# Altium project LPHR_WeatherStationPCB.PrjPcb (part 3 of 3)
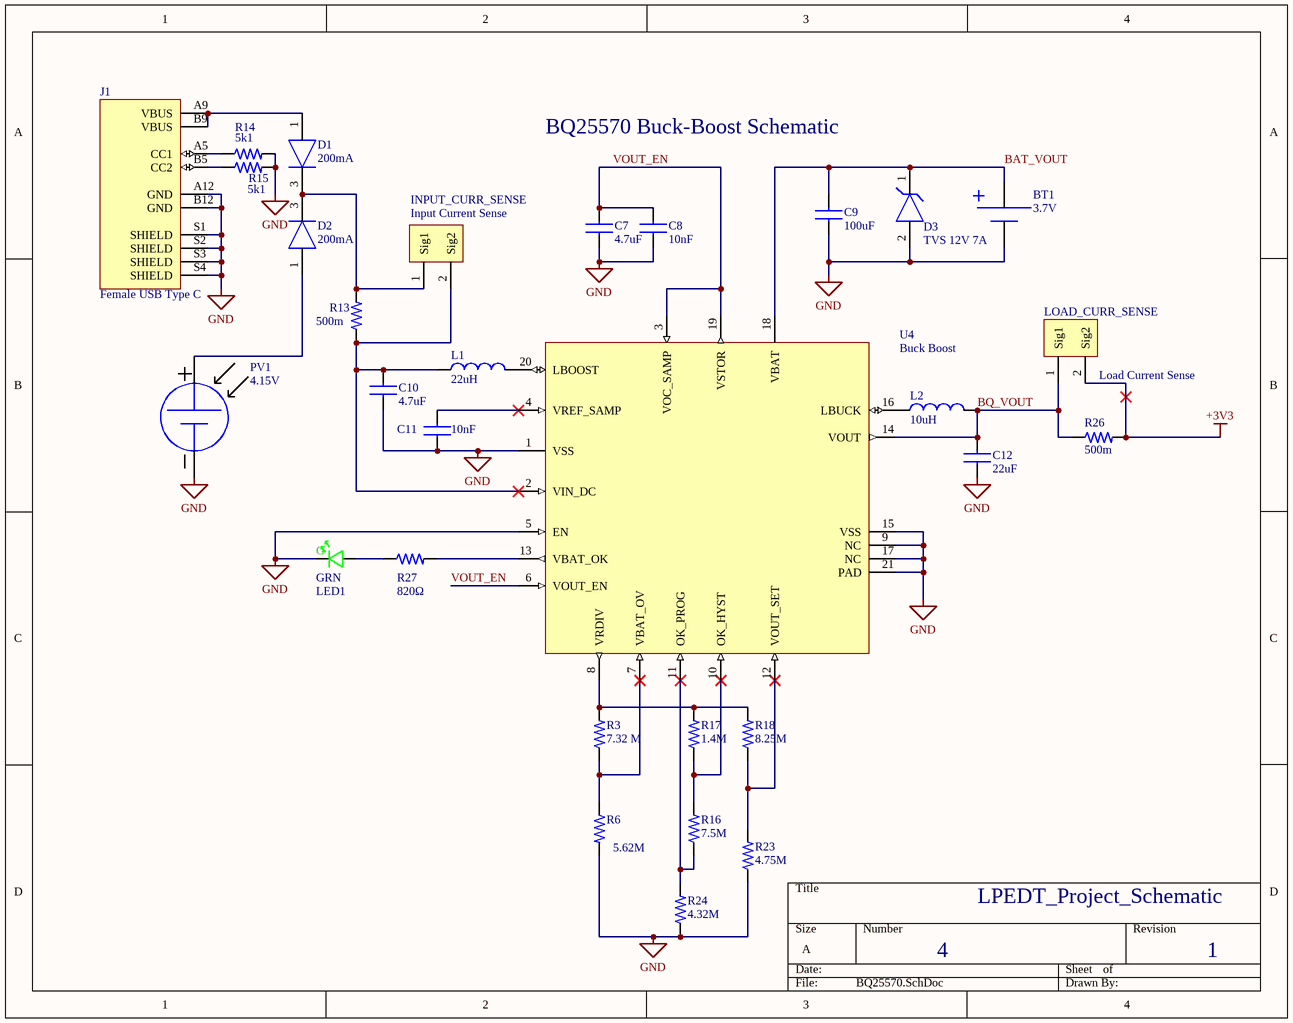
[diagram p8: BQ25570.SchDoc]

## Sheet BQ25570.SchDoc: LPEDT_Project_Schematic (continued)

### Library data of the parts (continued)
U4 = U_BQ25570RGRR: Power Supply Support Circuit, Adjustable, 1 Channel, PQCC20; Manufacturer: Texas Instruments; Package Body Material: Plastic; Channels: 1; Adjustable Threshold: Yes; Max Supply Voltage: 5.1V; Min Supply Voltage: 100mV; Supplier: Digikey; Supplier Part Number: 296-39934-1-ND; Manufacturer Part Number: BQ25570RGRR; RoHS: Yes; Category: Battery Management; Stock: 9240; Pricing: 1=7.11, 10=6.421, 25=6.1224, 100=5.3161, 250=5.07716, 500=4.62918, 1000=4.03187 (USD); Case/Package: HVQCCN; Pins: 20; Package Shape: Square; Terminal Finish: Nickel; Min Operating Temperature: -40°C; Max Operating Temperature: 85°C; Surface Mount: Yes; JESD-609 Code: e4; Throw Configuration: POWER SUPPLY SUPPORT CIRCUIT; Moisture Sensitivity Level: 2; Number of Channels: 1; Package Style: CHIP CARRIER, HEAT SINK/SLUG, VERY THIN PROFILEMeter; Peak Reflow Temperature (Cel): 260°C; Terminal Form: No Lead; Terminal Position: QUAD; Length: 3.5mm; Width: 3.5mm; Height - Seated (Max): 1mm; Terminal Pitch: 0.5mm; Reach SVHC Compliant: Yes; RoHS Compliant: Yes; Temperature Grade: INDUSTRIAL; ComponentLink1URL: https://www.ti.com:443/lit/ds/symlink/bq25570.pdf?src-supplier=IHS+Markit; ComponentLink1Description: https://www.ti.com:443/lit/ds/symlink/bq25570.pdf?src-supplier=IHS+Markit; ComponentLink2URL: https://datasheet.ciiva.com/29590/bq25570-29590060.pdf?src-supplier=Digikey; ComponentLink2Description: https://datasheet.ciiva.com/29590/bq25570-29590060.pdf?src-supplier=Digikey

## Sheet EFR32BG24_PartB.SchDoc: LPEDT_Project_Schematic
size A; Revision: 1; SheetNumber: 5; SheetTotal: 7
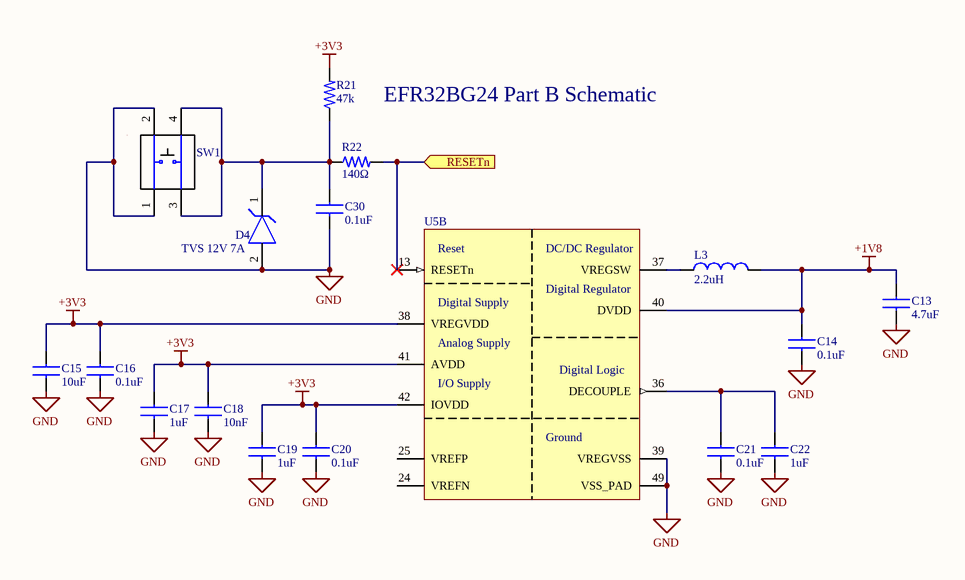
[diagram p4: EFR32BG24_PartB.SchDoc]

### Parts
C13  4.7uF  [C_0603]
C14  0.1uF  [C_0603]
C15  10uF  [C_0603]
C16  0.1uF  [C_0603]
C17  1uF  [C_0603]
C18  10nF  [C_0603]
C19  1uF  [C_0603]
C20  0.1uF  [C_0603]
C21  0.1uF  [C_0603]
C22  1uF  [C_0603]
C30  0.1uF  [C_0603]
D4  TVS 12V 7A  [D_TVS]
L3  2.2uH  [L_2828x30]
R21  47k  [R_0603]
R22  140Ω  [R_0603]
SW1  SW_TactilePushButton  [SW_Tactile]  (value not drawn)
U5  EFR32BG24B110F1536IM48-B  [U_48QFN_6x6_2]  (value not drawn)  (part B of 3)

### Ports
RESETn (in, see EFR32BG24_PartC[4A])

### Nets
+1V8: C13.1 C14.1 L3.2 U5.40(DVDD)
+3V3: C15.1 C16.2 C17.2 C18.1 C19.2 C20.2 R21.2 U5.38(VREGVDD) U5.41(AVDD) U5.42(IOVDD)
GND: C13.2 C14.2 C15.2 C16.1 C17.1 C18.2 C19.1 C20.1 C21.2 C22.2 C30.2 D4.2 SW1.1 SW1.2 U5.39(VREGVSS) U5.49(VSS_PAD)
NetC21_1: C21.1 C22.1 U5.36(DECOUPLE)
NetC30_1: C30.1 D4.1 R21.1 R22.1 SW1.3 SW1.4
NetH1_3: R22.2 U5.13(RESETn) ; port RESETn
NetL3_1: L3.1 U5.37(VREGSW)

Not connected (* = marked no-connect by the designer): U5 24(VREFN) 25(VREFP)

### Notes on the sheet
- EFR32BG24 Part B Schematic
- (in symbol EFR32BG24B110F1536IM48-B, part B) Reset; DC/DC Regulator; Digital Regulator; Digital Supply; Analog Supply; Digital Logic; I/O Supply; Ground

### Library data of the parts
C13 = C_4.7U_0603: CAP CER 4.7UF 10V X5R 0603; Manufacturer: Murata; Manufacturer Part Number: GRM188R61A475KAAJD; Dielectric Material: Ceramic; Multilayer: Yes; Tolerance  (fill in as +-): 10%; Supplier: Digikey; Supplier Part Number: 490-14373-1-ND; RoHS: Yes; Category: Ceramic Capacitors; Stock: 53982; Pricing: 1=0.38, 10=0.251, 50=0.185, 100=0.1506, 500=0.11888, 1000=0.10039 (USD); Mounting Technology: Surface Mount; Pins: 2; Package Shape: Rectangular; Case/Package: 0603; Terminal Finish: Nickel; Min Operating Temperature: -55°C; Max Operating Temperature: 85°C; JESD-609 Code: e3; Value: 4.7uF; Capacitor Type: Ceramic; Packaging: Tape and Reel; Tolerance (fill in as +-): 10%; Rated DC Voltage (URdc): 10V; Temperature Characteristics Code: X5R; Termination: Wraparound; Reach SVHC Compliant: Yes; RoHS Compliant: Yes; ComponentLink1URL: https://datasheet.ciiva.com:443/pdfs/VipMasterIC/IC/MURE/MURE-S-A0004349797/MURE-S-A0004352595-1.pdf?src-supplier=IHS+Markit; ComponentLink1Description: https://datasheet.ciiva.com:443/pdfs/VipMasterIC/IC/MURE/MURE-S-A0004349797/MURE-S-A0004352595-1.pdf?src-supplier=IHS+Markit; ComponentLink2URL: http://search.murata.co.jp/Ceramy/image/img/A01X/G101/ENG/GRM188R61A475KAAJ-01.pdf?src-supplier=Digikey; ComponentLink2Description: http://search.murata.co.jp/Ceramy/image/img/A01X/G101/ENG/GRM188R61A475KAAJ-01.pdf?src-supplier=Digikey
C14 C16 C20 C21 C30 = C_0.1U_0603: CAP CER 0.1UF 10V X5R 0603; Manufacturer: KEMET; Manufacturer Part Number: C0603C104K8PAC7867; Dielectric Material: Ceramic; Supplier: Digikey; Supplier Part Number: 399-17573-1-ND; RoHS: Yes; Category: Ceramic Capacitors; Stock: 13122; Pricing: 1=0.18, 10=0.119, 50=0.075, 100=0.06, 500=0.04332, 1000=0.03833 (USD); Pins: 2; Capacitor Type: Ceramic; Reach SVHC Compliant: Yes; RoHS Compliant: Yes; ComponentLink1URL: https://datasheet.ciiva.com:443/pdfs/VipMasterIC/IC/KEME/KEME-S-A0007617622/KEME-S-A0007611556-1.pdf?src-supplier=IHS+Markit; ComponentLink1Description: https://datasheet.ciiva.com:443/pdfs/VipMasterIC/IC/KEME/KEME-S-A0007617622/KEME-S-A0007611556-1.pdf?src-supplier=IHS+Markit; ComponentLink2URL: https://api.kemet.com/component-edge/download/datasheet/C0603C104K8PAC7867.pdf?src-supplier=Digikey; ComponentLink2Description: https://api.kemet.com/component-edge/download/datasheet/C0603C104K8PAC7867.pdf?src-supplier=Digikey
C15 = C_10U_0603: CAP CER 10UF 10V X5R 0603; Manufacturer: Murata; Manufacturer Part Number: GRM188R61A106ME69D; Dielectric Material: Ceramic; Multilayer: Yes; Tolerance  (fill in as +-): 20%; Supplier: Digikey; Supplier Part Number: 490-10475-1-ND; RoHS: Yes; Category: Ceramic Capacitors; Stock: 841748; Pricing: 1=0.14, 10=0.098, 50=0.0584, 100=0.0459, 500=0.03392, 1000=0.02809 (USD); Mounting Technology: Surface Mount; Pins: 2; Package Shape: Rectangular; Case/Package: 0603; Terminal Finish: Nickel; Min Operating Temperature: -55°C; Max Operating Temperature: 85°C; JESD-609 Code: e3; Value: 10uF; Capacitor Type: Ceramic; Packaging: Tape and Reel; Tolerance (fill in as +-): 20%; Rated DC Voltage (URdc): 10V; Temperature Characteristics Code: X5R; Termination: Wraparound; Reach SVHC Compliant: Yes; RoHS Compliant: Yes; ComponentLink1URL: https://datasheet.ciiva.com:443/pdfs/VipMasterIC/IC/MURE/MURE-S-A0004349797/MURE-S-A0004352786-1.pdf?src-supplier=IHS+Markit; ComponentLink1Description: https://datasheet.ciiva.com:443/pdfs/VipMasterIC/IC/MURE/MURE-S-A0004349797/MURE-S-A0004352786-1.pdf?src-supplier=IHS+Markit; ComponentLink2URL: http://www.farnell.com/datasheets/1872210.pdf?src-supplier=Farnell; ComponentLink2Description: http://www.farnell.com/datasheets/1872210.pdf?src-supplier=Farnell; ComponentLink3URL: http://www.mouser.com/ds/2/281/c02e-2905.pdf?src-supplier=Mouser; ComponentLink3Description: http://www.mouser.com/ds/2/281/c02e-2905.pdf?src-supplier=Mouser; ComponentLink4URL: https://datasheet.octopart.com/GRM188R61A106ME69D-Murata-datasheet-22122223.pdf?src-supplier=Future+Electronics; ComponentLink4Description: https://datasheet.octopart.com/GRM188R61A106ME69D-Murata-datasheet-22122223.pdf?src-supplier=Future+Electronics; ComponentLink5URL: https://datasheet.octopart.com/GRM188R61A106ME69D-Murata-datasheet-62317187.pdf?src-supplier=Element14; ComponentLink5Description: https://datasheet.octopart.com/GRM188R61A106ME69D-Murata-datasheet-62317187.pdf?src-supplier=Element14; ComponentLink6URL: http://www.farnell.com/datasheets/1872210.pdf?src-supplier=Newark; ComponentLink6Description: http://www.farnell.com/datasheets/1872210.pdf?src-supplier=Newark; ComponentLink7URL: http://www.farnell.com/datasheets/2048014.pdf?src-supplier=Element14; ComponentLink7Description: http://www.farnell.com/datasheets/2048014.pdf?src-supplier=Element14; ComponentLink8URL: https://datasheet.octopart.com/GRM188R61A106ME69D-Murata-datasheet-165579666.pdf?src-supplier=TME; ComponentLink8Description: https://datasheet.octopart.com/GRM188R61A106ME69D-Murata-datasheet-165579666.pdf?src-supplier=TME
C17 C19 C22 = C_1U_0603: CAP CER 1UF 10V X5R 0603; Manufacturer: Murata; Manufacturer Part Number: GRM188R61A105KA61D; Dielectric Material: Ceramic; Multilayer: Yes; Tolerance  (fill in as +-): 10%; Supplier: Digikey; Supplier Part Number: 490-1543-1-ND; RoHS: Yes; Category: Ceramic Capacitors; Stock: 1314759; Pricing: 1=0.12, 10=0.08, 50=0.048, 100=0.0378, 500=0.02794, 1000=0.02313 (USD); Mounting Technology: Surface Mount; Pins: 2; Package Shape: Rectangular; Case/Package: 0603; Terminal Finish: Nickel; Min Operating Temperature: -55°C; Max Operating Temperature: 85°C; JESD-609 Code: e3; Value: 1uF; Capacitor Type: Ceramic; Package Style: SMTMeter; Packaging: Tape and Reel; Tolerance (fill in as +-): 10%; Rated DC Voltage (URdc): 10V; Temperature Characteristics Code: X5R; Termination: Wraparound; Length: 1.6mm; Width: 0.8mm; Height: 0.8mm; Reach SVHC Compliant: Yes; RoHS Compliant: Yes; ComponentLink1URL: https://psearch.en.murata.com:443/capacitor/product/GRM188R61A105KA61%23.pdf?src-supplier=IHS+Markit; ComponentLink1Description: https://psearch.en.murata.com:443/capacitor/product/GRM188R61A105KA61%23.pdf?src-supplier=IHS+Markit; ComponentLink2URL: https://datasheet.ciiva.com/19476/1857381-19476568.pdf?src-supplier=Jameco; ComponentLink2Description: https://datasheet.ciiva.com/19476/1857381-19476568.pdf?src-supplier=Jameco; ComponentLink3URL: https://datasheet.ciiva.com/18102/getdatasheetpartid-85467-18102910.pdf?src-supplier=Verical; ComponentLink3Description: https://datasheet.ciiva.com/18102/getdatasheetpartid-85467-18102910.pdf?src-supplier=Verical; ComponentLink4URL: https://datasheet.ciiva.com/7719/608985-7719036.pdf?src-supplier=Element14; ComponentLink4Description: https://datasheet.ciiva.com/7719/608985-7719036.pdf?src-supplier=Element14; ComponentLink5URL: https://datasheet.ciiva.com/22706/608985-22706782.pdf?src-supplier=Element14; ComponentLink5Description: https://datasheet.ciiva.com/22706/608985-22706782.pdf?src-supplier=Element14; ComponentLink6URL: https://datasheet.ciiva.com/131/partnumbering-e-01-131742.pdf?src-supplier=Digikey; ComponentLink6Description: https://datasheet.ciiva.com/131/partnumbering-e-01-131742.pdf?src-supplier=Digikey; ComponentLink7URL: https://datasheet.ciiva.com/131/partnumbering-e-01-131741.pdf?src-supplier=Digikey; ComponentLink7Description: https://datasheet.ciiva.com/131/partnumbering-e-01-131741.pdf?src-supplier=Digikey; ComponentLink8URL: https://datasheet.ciiva.com/131/partnumbering-e-01-131743.pdf?src-supplier=Digikey; ComponentLink8Description: https://datasheet.ciiva.com/131/partnumbering-e-01-131743.pdf?src-supplier=Digikey; ComponentLink9URL: https://datasheet.ciiva.com/16199/product-16199724.pdf?src-supplier=Future+Electronics; ComponentLink9Description: https://datasheet.ciiva.com/16199/product-16199724.pdf?src-supplier=Future+Electronics
C18 = C_10N_0603: Ceramic Capacitor, Multilayer, Ceramic, 100V, 10% +Tol, 10% -Tol, X7R, 15% TC, 0.01uF, Surface Mount, 0603; Manufacturer: Murata; Manufacturer Part Number: GCM188R72A103KA37D; Multilayer: Yes; Reference Standard: AEC-Q200; Supplier: Digikey; Supplier Part Number: 490-4781-6-ND; RoHS: Yes; Category: Ceramic Capacitors; Stock: 7901608; Pricing: 1=0.1, 10=0.038, 50=0.0218, 100=0.0168, 500=0.01268, 1000=0.00996 (USD); Mounting Technology: Surface Mount; Pins: 2; Dielectric Material: Ceramic; Package Shape: Rectangular; Case/Package: 0603; Terminal Finish: Nickel; Min Operating Temperature: -55°C; Max Operating Temperature: 125°C; JESD-609 Code: e3; Value: 10nF; Capacitor Type: Ceramic; Tolerance  (fill in as +-): 10%; Package Style: SMTMeter; Packaging: Tape and Reel; Tolerance (fill in as +-): 10%; Rated DC Voltage (URdc): 100V; Temperature Characteristics Code: X7R; Termination: Wraparound; Length: 1.6mm; Width: 0.8mm; Height: 0.9mm; Reach SVHC Compliant: Yes; RoHS Compliant: Yes; ComponentLink1URL: https://psearch.en.murata.com:443/capacitor/product/GCM188R72A103KA37%23.pdf?src-supplier=IHS+Markit; ComponentLink1Description: https://psearch.en.murata.com:443/capacitor/product/GCM188R72A103KA37%23.pdf?src-supplier=IHS+Markit; ComponentLink2URL: https://datasheet.ciiva.com/132/product-132908.pdf?src-supplier=Digikey; ComponentLink2Description: https://datasheet.ciiva.com/132/product-132908.pdf?src-supplier=Digikey; ComponentLink3URL: https://datasheet.ciiva.com/132/product-132907.pdf?src-supplier=Digikey; ComponentLink3Description: https://datasheet.ciiva.com/132/product-132907.pdf?src-supplier=Digikey; ComponentLink4URL: https://datasheet.ciiva.com/132/product-132909.pdf?src-supplier=Digikey; ComponentLink4Description: https://datasheet.ciiva.com/132/product-132909.pdf?src-supplier=Digikey; ComponentLink5URL: https://datasheet.ciiva.com/11786/0900766b80ef92d0-11786108.pdf?src-supplier=Rs; ComponentLink5Description: https://datasheet.ciiva.com/11786/0900766b80ef92d0-11786108.pdf?src-supplier=Rs; ComponentLink6URL: https://datasheet.ciiva.com/16497/product-16497251.pdf?src-supplier=Future+Electronics; ComponentLink6Description: https://datasheet.ciiva.com/16497/product-16497251.pdf?src-supplier=Future+Electronics; ComponentLink7URL: https://datasheet.ciiva.com/18183/getdatasheetpartid-178890-18183651.pdf?src-supplier=Verical; ComponentLink7Description: https://datasheet.ciiva.com/18183/getdatasheetpartid-178890-18183651.pdf?src-supplier=Verical; ComponentLink8URL: https://datasheet.ciiva.com/11619/product-11619719.pdf?src-supplier=Avnet; ComponentLink8Description: https://datasheet.ciiva.com/11619/product-11619719.pdf?src-supplier=Avnet
D4 = D_TVS_7A: TVS DIODE 5VWM 12VC SOD723; Manufacturer: Littelfuse; Manufacturer Part Number: SP1003-01DTG; Direction: Unidirectional; Reverse Breakdown Voltage: 6V; Operating Supply Voltage: 5V; Value: 30pF; Number of Channels: 1; Power Line Protection: No; Polarity: Bidirectional,Unidirectional; Test Current: 1mA; Leakage Current: 100nA; Diode Type: ZENER; Clamping Voltage-Max: 12.5V; Supplier: Digikey; Supplier Part Number: F3377CT-ND; RoHS: Yes; Category: TVS Diodes; Stock: 109631; Pricing: 1=0.53, 10=0.41, 100=0.2459, 500=0.22772, 1000=0.15485, 2000=0.14255 (USD); Mounting Technology: Surface Mount; Pins: 2; Min Operating Temperature: -40°C; Max Operating Temperature: 85°C; Packaging: Tape and Reel; Package Quantity: 8000; Max Surge Current: 7A; Number of Unidirectional Channels: 1; Reverse Standoff Voltage: 5V; Min Breakdown Voltage: 6V; Clamping Voltage: 12V; Breakdown Voltage: 5V; Termination: SMD/SMT; Number of Elements: 1; Peak Pulse Current: 7A; Series: SP1003, SPA®; Reach SVHC Compliant: No; Lead Free: Lead Free; RoHS Compliant: Yes; ComponentLink1URL: https://datasheet.ciiva.com/8062/littelfuse-spa-sp1003-series-8062432.pdf?src-supplier=Element14; ComponentLink1Description: https://datasheet.ciiva.com/8062/littelfuse-spa-sp1003-series-8062432.pdf?src-supplier=Element14; ComponentLink2URL: https://datasheet.ciiva.com/5771/littelfuse-spa-sp1003-series-5771141.pdf?src-supplier=Farnell; ComponentLink2Description: https://datasheet.ciiva.com/5771/littelfuse-spa-sp1003-series-5771141.pdf?src-supplier=Farnell; ComponentLink3URL: https://datasheet.ciiva.com/330/littelfuse-tvs-diode-array-sp1003-datasheet-pdf-330691.pdf?src-supplier=Digikey; ComponentLink3Description: https://datasheet.ciiva.com/330/littelfuse-tvs-diode-array-sp1003-datasheet-pdf-330691.pdf?src-supplier=Digikey; ComponentLink4URL: https://datasheet.ciiva.com/330/littelfuse-tvs-diode-array-sp1003-datasheet-pdf-330692.pdf?src-supplier=Digikey; ComponentLink4Description: https://datasheet.ciiva.com/330/littelfuse-tvs-diode-array-sp1003-datasheet-pdf-330692.pdf?src-supplier=Digikey; ComponentLink5URL: https://datasheet.ciiva.com/330/littelfuse-tvs-diode-array-sp1003-datasheet-pdf-330693.pdf?src-supplier=Digikey; ComponentLink5Description: https://datasheet.ciiva.com/330/littelfuse-tvs-diode-array-sp1003-datasheet-pdf-330693.pdf?src-supplier=Digikey
L3 = L_2U2_2828: General Purpose Inductor, 2.2uH, 20%, 1 Element, Ferrite-Core, SMD, 1111; Manufacturer: Wurth Electronics; Manufacturer Part Number: 744025002; Channels: 1; Case/Size Code: 1111; DC Resistance (DCR): 101mR; Inductor Application: RF INDUCTOR; Max Current Rating: 1.5A; Self Resonant Frequency: 100MHz; Shape/Size Description: RECTANGULAR PACKAGE; Shielding: Unshielded; Test Frequency: 100kHz; Package Height: 2.8mm; Supplier: Digikey; Supplier Part Number: 732-2613-1-ND; RoHS: Yes; Category: Fixed Inductors; Stock: 733; Pricing: 1=1.64, 10=1.578, 50=1.45, 100=1.205, 250=1.088 (USD); Pins: 2; Terminal Finish: Copper; Core Material: Ferrite; Min Operating Temperature: -40°C; Max Operating Temperature: 125°C; Tolerance: 20%; JESD-609 Code: e2; Package Style: SMTMeter; Surface Mount: Yes; Construction: Chip; Inductance-Nom (L): 2.2uH; Inductor Type: GENERAL PURPOSE INDUCTOR; Packaging: Tape and Reel; Terminal Placement: Dual Ended; Termination: Wraparound; Package Length: 2.8mm; Package Width: 2.8mm; Reach SVHC Compliant: Yes; RoHS Compliant: Yes; ComponentLink1URL: https://datasheet.ciiva.com:443/pdfs/VipMasterIC/IC/MIDC/MIDC-S-A0002801410/MIDC-S-A0002801309-1.pdf?src-supplier=IHS+Markit; ComponentLink1Description: https://datasheet.ciiva.com:443/pdfs/VipMasterIC/IC/MIDC/MIDC-S-A0002801410/MIDC-S-A0002801309-1.pdf?src-supplier=IHS+Markit; ComponentLink2URL: https://datasheet.ciiva.com/4954/744025002-18097-4954597.pdf?src-supplier=Mouser; ComponentLink2Description: https://datasheet.ciiva.com/4954/744025002-18097-4954597.pdf?src-supplier=Mouser; ComponentLink3URL: https://datasheet.ciiva.com/6690/744025002-6690395.pdf?src-supplier=Digikey; ComponentLink3Description: https://datasheet.ciiva.com/6690/744025002-6690395.pdf?src-supplier=Digikey; ComponentLink4URL: https://datasheet.ciiva.com/11803/0900766b80f886b4-11803596.pdf?src-supplier=Rs; ComponentLink4Description: https://datasheet.ciiva.com/11803/0900766b80f886b4-11803596.pdf?src-supplier=Rs; ComponentLink5URL: https://datasheet.ciiva.com/6690/744025002-6690396.pdf?src-supplier=Digikey; ComponentLink5Description: https://datasheet.ciiva.com/6690/744025002-6690396.pdf?src-supplier=Digikey; ComponentLink6URL: https://datasheet.ciiva.com/6690/744025002-6690397.pdf?src-supplier=Digikey; ComponentLink6Description: https://datasheet.ciiva.com/6690/744025002-6690397.pdf?src-supplier=Digikey; ComponentLink7URL: https://datasheet.ciiva.com/48690/001087101-da-01-ml-we-tpc-smd-speicherdrossel-7440250-de-en-48690919.pdf?src-supplier=Conrad; ComponentLink7Description: https://datasheet.ciiva.com/48690/001087101-da-01-ml-we-tpc-smd-speicherdrossel-7440250-de-en-48690919.pdf?src-supplier=Conrad
R21 = R_47K_0603: Fixed Resistor, Metal Glaze/thick Film, 0.1W, 47000ohm, 75V, 1% +/-Tol, 100ppm/Cel, Surface Mount, 0603; Manufacturer: Yageo; Manufacturer Part Number: RC0603FR-0747KL; Additional Feature: LASER TRIMMABLE; Power: 100mW; Rated Temperature: 70°C; Value: 47kR; Temperature Coefficient: 100ppm/°C; Package Height: 0.45mm; Package Length: 1.6mm; Package Width: 0.8mm; Supplier: Digikey; Supplier Part Number: 311-47.0KHRCT-ND; RoHS: Yes; Category: Chip SMD Resistors; Stock: 9516223; Pricing: 1=0.1, 10=0.019, 50=0.0112, 100=0.0093, 500=0.00622, 1000=0.00532 (USD); Mounting Technology: Surface Mount; Pins: 2; Package Shape: Rectangular; Case/Package: 0603; Terminal Finish: Nickel; Min Operating Temperature: -55°C; Max Operating Temperature: 155°C; Tolerance: 1%; JESD-609 Code: e3; Resistor Type: FIXED RESISTOR; Construction: Chip; Package Style: SMTMeter; Packaging: Tape and Reel; Technology: METAL GLAZE/THICK FILM; Termination: Wraparound; Working Voltage: 75V; Reach SVHC Compliant: Yes; RoHS Compliant: Yes; ComponentLink1URL: https://datasheet.ciiva.com:443/pdfs/VipMasterIC/IC/YAGO/YAGO-S-A0008145938/YAGO-S-A0008145938-1.pdf?src-supplier=IHS+Markit; ComponentLink1Description: https://datasheet.ciiva.com:443/pdfs/VipMasterIC/IC/YAGO/YAGO-S-A0008145938/YAGO-S-A0008145938-1.pdf?src-supplier=IHS+Markit; ComponentLink2URL: https://datasheet.ciiva.com/11808/0900766b80f96399-11808118.pdf?src-supplier=Rs; ComponentLink2Description: https://datasheet.ciiva.com/11808/0900766b80f96399-11808118.pdf?src-supplier=Rs; ComponentLink3URL: https://datasheet.ciiva.com/2453/pyu-r-int-thick-7-2453932.pdf?src-supplier=Digikey; ComponentLink3Description: https://datasheet.ciiva.com/2453/pyu-r-int-thick-7-2453932.pdf?src-supplier=Digikey; ComponentLink4URL: https://datasheet.ciiva.com/2453/pyu-r-int-thick-7-2453933.pdf?src-supplier=Digikey; ComponentLink4Description: https://datasheet.ciiva.com/2453/pyu-r-int-thick-7-2453933.pdf?src-supplier=Digikey; ComponentLink5URL: https://datasheet.ciiva.com/2453/pyu-r-int-thick-7-2453931.pdf?src-supplier=Digikey; ComponentLink5Description: https://datasheet.ciiva.com/2453/pyu-r-int-thick-7-2453931.pdf?src-supplier=Digikey; ComponentLink6URL: https://datasheet.ciiva.com/7746/443971-7746362.pdf?src-supplier=Element14; ComponentLink6Description: https://datasheet.ciiva.com/7746/443971-7746362.pdf?src-supplier=Element14; ComponentLink7URL: https://datasheet.ciiva.com/7746/443971-7746361.pdf?src-supplier=Element14; ComponentLink7Description: https://datasheet.ciiva.com/7746/443971-7746361.pdf?src-supplier=Element14
R22 = R_140_0603: RES 140OHM 0.1w 0603; Manufacturer: Yageo; Manufacturer Part Number: RC0603FR-07140RL; Tolerance: 1%; Additional Feature: LASER TRIMMABLE; Power: 100mW; Rated Temperature: 70°C; Value: 140R; Temperature Coefficient: 100ppm/°C; Working Voltage: 75V; Package Height: 0.45mm; Package Length: 1.6mm; Package Width: 0.8mm; Supplier: Digikey; Supplier Part Number: 311-140HRCT-ND; RoHS: Yes; Category: Chip SMD Resistors; Stock: 298380; Pricing: 1=0.1, 10=0.019, 50=0.0112, 100=0.0093, 500=0.00622, 1000=0.00532 (USD); Mounting Technology: Surface Mount; Pins: 2; Package Shape: Rectangular; Case/Package: 0603; Terminal Finish: Nickel; Min Operating Temperature: -55°C; Max Operating Temperature: 155°C; JESD-609 Code: e3; Resistor Type: FIXED RESISTOR; Construction: Chip; Package Style: SMTMeter; Packaging: Tape and Reel; Technology: METAL GLAZE/THICK FILM; Termination: Wraparound; Reach SVHC Compliant: Yes; RoHS Compliant: Yes; ComponentLink1URL: https://datasheet.ciiva.com:443/pdfs/VipMasterIC/IC/YAGO/YAGO-S-A0008145938/YAGO-S-A0008145938-1.pdf?src-supplier=IHS+Markit; ComponentLink1Description: https://datasheet.ciiva.com:443/pdfs/VipMasterIC/IC/YAGO/YAGO-S-A0008145938/YAGO-S-A0008145938-1.pdf?src-supplier=IHS+Markit; ComponentLink2URL: https://datasheet.ciiva.com/11808/0900766b80c66297-11808828.pdf?src-supplier=Rs; ComponentLink2Description: https://datasheet.ciiva.com/11808/0900766b80c66297-11808828.pdf?src-supplier=Rs; ComponentLink3URL: https://datasheet.ciiva.com/15189/getdatasheetpartid-329205-15189606.pdf?src-supplier=Verical; ComponentLink3Description: https://datasheet.ciiva.com/15189/getdatasheetpartid-329205-15189606.pdf?src-supplier=Verical
SW1 = SW_TactilePushButton: 6 x 6 mm, 4.3 ~ 17 mm Actuator Height, 100 ~ 260 gf, Through Hole, SPST, Tactile Switch; Manufacturer: CUI Devices; Manufacturer Part Number: TS02-66-60-BK-100-LCR-D; Supplier: Digikey; Supplier Part Number: 2223-TS02-66-60-BK-100-LCR-D-ND; RoHS: No; Category: Tactile Switches; Stock: 3824; Pricing: 1=0.1, 10=0.097, 25=0.0916, 100=0.0833, 250=0.07832, 500=0.07166, 1000=0.05999, 2500=0.05833, 5000=0.05499 (USD)
U5 = EFR32BG24B110F1536IM48-B: BG24, 2.4 GHz, 1536kB Flash, 256kB RAM, +10 dBm, Secure Vault High, 20-bit ADC +125C, QFN48; Manufacturer: Silicon Labs; Supplier: Digikey; Supplier Part Number: 336-EFR32BG24B110F1536IM48-B-ND; Manufacturer Part Number: EFR32BG24B110F1536IM48-B; RoHS: No; Category: RF Receivers, Transceivers; Stock: 2713; Pricing: 1=7.9, 10=7.244, 25=6.5852, 80=5.92663, 230=5.43278, 490=4.9389, 980=4.44501 (USD)

## Sheet EFR32BG24_PartC.SchDoc: LPEDT_Project_Schematic
size A; Revision: 1; SheetNumber: 6; SheetTotal: 7
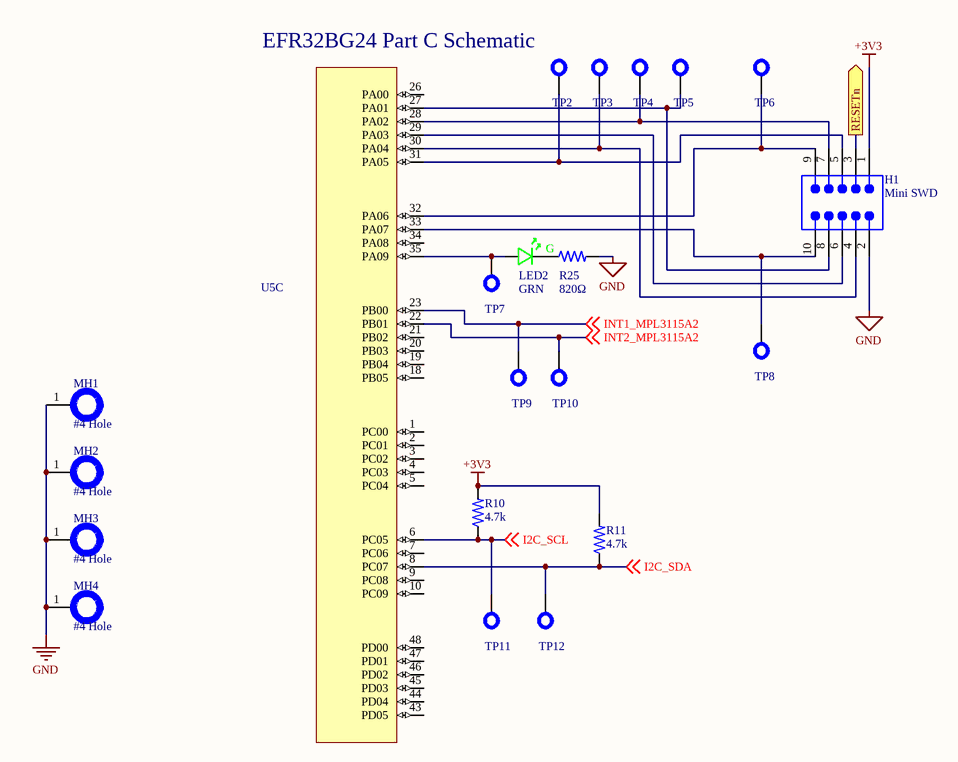
[diagram p5: EFR32BG24_PartC.SchDoc]

### Parts
H1  Mini SWD  [FTSH-105-01-XXX-DV-K]
LED2  GRN  [LED_0603]
MH1  #4 Hole  [HOLE_#4]  (no BOM)
MH2  #4 Hole  [HOLE_#4]  (no BOM)
MH3  #4 Hole  [HOLE_#4]  (no BOM)
MH4  #4 Hole  [HOLE_#4]  (no BOM)
R10  4.7k  [R_0603]
R11  4.7k  [R_0603]
R25  820Ω  [R_0603]
TP2  TP_1PIN_Hole  [Test Point]  (value not drawn)
TP3  TP_1PIN_Hole  [Test Point]  (value not drawn)
TP4  TP_1PIN_Hole  [Test Point]  (value not drawn)
TP5  TP_1PIN_Hole  [Test Point]  (value not drawn)
TP6  TP_1PIN_Hole  [Test Point]  (value not drawn)
TP7  TP_1PIN_Hole  [Test Point]  (value not drawn)
TP8  TP_1PIN_Hole  [Test Point]  (value not drawn)
TP9  TP_1PIN_Hole  [Test Point]  (value not drawn)
TP10  TP_1PIN_Hole  [Test Point]  (value not drawn)
TP11  TP_1PIN_Hole  [Test Point]  (value not drawn)
TP12  TP_1PIN_Hole  [Test Point]  (value not drawn)
U5  EFR32BG24B110F1536IM48-B  [U_48QFN_6x6_2]  (value not drawn)  (part C of 3)

### Ports
RESETn (out, see EFR32BG24_PartB[2A])

### Nets
+3V3: H1.1 R10.2 R11.2
GND: H1.2 MH1.1 MH2.1 MH3.1 MH4.1 R25.2
I2C_SCL: R10.1 TP11.1 U5.6(PC05) ; off-sheet I2C_SCL
I2C_SDA: R11.1 TP12.1 U5.8(PC07) ; off-sheet I2C_SDA
INT1_MPL3115A2: TP9.1 U5.23(PB00) ; off-sheet INT1_MPL3115A2
INT2_MPL3115A2: TP10.1 U5.22(PB01) ; off-sheet INT2_MPL3115A2
NetH1_3: H1.3 ; port RESETn
NetH1_4: H1.4 TP3.1 U5.30(PA04)
NetH1_5: H1.5 TP2.1 U5.31(PA05)
NetH1_6: H1.6 U5.29(PA03)
NetH1_7: H1.7 TP4.1 U5.28(PA02)
NetH1_8: H1.8 TP5.1 U5.27(PA01)
NetH1_9: H1.9 TP6.1 U5.32(PA06)
NetH1_10: H1.10 TP8.1 U5.33(PA07)
NetLED2_A: LED2.A TP7.1 U5.35(PA09)
NetLED2_C: LED2.C R25.1

Not connected (* = marked no-connect by the designer): U5 1(PC00) 2(PC01) 3(PC02) 4(PC03) 5(PC04) 7(PC06) 9(PC08) 10(PC09) 18(PB05) 19(PB04) 20(PB03) 21(PB02) 26(PA00) 34(PA08) 43(PD05) 44(PD04) 45(PD03) 46(PD02) 47(PD01) 48(PD00)

### Notes on the sheet
- (near TP2) EFR32BG24 Part C Schematic
- (in symbol LED_GREEN_0603) G

### Library data of the parts
H1 = Debug Connector Mini SWD - 0.05": Mini SWD 0.05" Pitch Connector - 10 Pin SMT Box Header; Manufacturer: Adafruit Industries; Manufacturer Part Number: 4048; Supplier 1: Digi-Key; RoHS: No; Category: Connectors; Stock 1: 201; Pricing 1: 1=1.95000 (USD); ComponentLink1URL: https://media.digikey.com/pdf/Data%20Sheets/Adafruit%20PDFs/4048_Web.pdf?src-supplier=Digi-Key; ComponentLink1Description: https://media.digikey.com/pdf/Data%20Sheets/Adafruit%20PDFs/4048_Web.pdf?src-supplier=Digi-Key
LED2 = LED_GREEN_0603: LED, 0603, GREEN, 430MCD, 520NM; Manufacturer: Wurth Electronics; Manufacturer Part Number: 150060GS75000; Dynamic Catalog: 0603 Rectangle with Flat Top Chip LEDs; 3D Model: SMCW_0603.igs / SMCW_0603.stp / SMCW_0603.wrl; Wavelength - Peak: 515nm; Voltage - Forward (Vf) (Typ): 3.2V; Current - Test: 20mA; Viewing Angle: 140°; Lens Type: Clear; Lens Style/Size: Rectangle with Flat Top, 1.1mm x 0.7mm; Other Names: 732-4971-2; Supplier 1: Digi-Key; Stock 1: 34964; Pricing 1: 1=0.14, 50=0.129, 100=0.11, 500=0.095 (USD); Standard Package: 4,000; Category: Optoelectronics; Family: LED Indication - Discrete; Series: WL-SMCW; Packaging: Tape & Reel (TR); Color: Green; Wavelength - Dominant: 520nm; Millicandela Rating: 430mcd; Package / Case: 0603 (1608 Metric); Size / Dimension: 1.60mm L x 0.80mm W; Height: 0.70mm; Mounting Type: Surface Mount; Online Catalog: 0603 Rectangle with Flat Top Chip LEDs; ComponentLink1URL: https://katalog.we-online.de/led/datasheet/150060GS75000.pdf?src-supplier=Digi-Key; ComponentLink1Description: https://katalog.we-online.de/led/datasheet/150060GS75000.pdf?src-supplier=Digi-Key; ComponentLink2URL: http://www.produktinfo.conrad.com/datenblaetter/750000-774999/759427-da-01-en-CHIPLED_0603_W_KL_GRUEN_150060GS75000.pdf?src-supplier=Conrad; ComponentLink2Description: http://www.produktinfo.conrad.com/datenblaetter/750000-774999/759427-da-01-en-CHIPLED_0603_W_KL_GRUEN_150060GS75000.pdf?src-supplier=Conrad; Supplier Part Number 1: 732-4971-1-ND
MH1-MH4 = HOLE_#4
R10 R11 = R_4K7_0603: Fixed Resistor, Metal Glaze/thick Film, 0.1W, 4700ohm, 75V, 1% +/-Tol, 100ppm/Cel, Surface Mount, 0603; Manufacturer: Yageo; Manufacturer Part Number: RC0603FR-074K7L; Additional Feature: LASER TRIMMABLE; Power: 100mW; Rated Temperature: 70°C; Value: 4.7kR; Temperature Coefficient: 100ppm/°C; Package Height: 0.45mm; Package Length: 1.6mm; Package Width: 0.8mm; Supplier: Digikey; Supplier Part Number: 311-4.70KHRCT-ND; RoHS: Yes; Category: Chip SMD Resistors; Stock: 5392197; Pricing: 1=0.1, 10=0.019, 50=0.0112, 100=0.0093, 500=0.00622, 1000=0.00532 (USD); Mounting Technology: Surface Mount; Pins: 2; Package Shape: Rectangular; Case/Package: 0603; Terminal Finish: Nickel; Min Operating Temperature: -55°C; Max Operating Temperature: 155°C; Tolerance: 1%; JESD-609 Code: e3; Resistor Type: FIXED RESISTOR; Construction: Chip; Package Style: SMTMeter; Packaging: Tape and Reel; Technology: METAL GLAZE/THICK FILM; Termination: Wraparound; Working Voltage: 75V; Reach SVHC Compliant: Yes; RoHS Compliant: Yes; ComponentLink1URL: https://datasheet.ciiva.com:443/pdfs/VipMasterIC/IC/YAGO/YAGO-S-A0008145938/YAGO-S-A0008145938-1.pdf?src-supplier=IHS+Markit; ComponentLink1Description: https://datasheet.ciiva.com:443/pdfs/VipMasterIC/IC/YAGO/YAGO-S-A0008145938/YAGO-S-A0008145938-1.pdf?src-supplier=IHS+Markit; ComponentLink2URL: https://datasheet.ciiva.com/15189/getdatasheetpartid-422754-15189760.pdf?src-supplier=Verical; ComponentLink2Description: https://datasheet.ciiva.com/15189/getdatasheetpartid-422754-15189760.pdf?src-supplier=Verical; ComponentLink3URL: https://datasheet.ciiva.com/7660/38590-7660794.pdf?src-supplier=Element14; ComponentLink3Description: https://datasheet.ciiva.com/7660/38590-7660794.pdf?src-supplier=Element14; ComponentLink4URL: https://datasheet.ciiva.com/22747/443971-22747528.pdf?src-supplier=Element14; ComponentLink4Description: https://datasheet.ciiva.com/22747/443971-22747528.pdf?src-supplier=Element14; ComponentLink5URL: https://datasheet.ciiva.com/46440/1868787-46440909.pdf?src-supplier=Element14; ComponentLink5Description: https://datasheet.ciiva.com/46440/1868787-46440909.pdf?src-supplier=Element14; ComponentLink6URL: https://datasheet.ciiva.com/7746/1868787-7746365.pdf?src-supplier=Element14; ComponentLink6Description: https://datasheet.ciiva.com/7746/1868787-7746365.pdf?src-supplier=Element14; ComponentLink7URL: https://datasheet.ciiva.com/7746/1738695-7746366.pdf?src-supplier=Element14; ComponentLink7Description: https://datasheet.ciiva.com/7746/1738695-7746366.pdf?src-supplier=Element14
R25 = R_820_0603: RES 820OHM 0.1W 0603; Manufacturer: Stackpole Electronics; Manufacturer Part Number: RMCF0603FT820R; Tolerance: 1%; Power: 100mW; Rated Temperature: 70°C; Value: 820R; Temperature Coefficient: 100ppm/°C; Working Voltage: 75V; Package Height: 0.45mm; Package Length: 1.55mm; Package Width: 0.8mm; Reference Standard: AEC-Q200; Supplier: Digikey; Supplier Part Number: RMCF0603FT820RDKR-ND; RoHS: Yes; Category: Chip SMD Resistors; Stock: 449150; Pricing: 1=0.1, 10=0.015, 50=0.009, 100=0.0075, 500=0.00498, 1000=0.00425 (USD); Mounting Technology: Surface Mount; Pins: 2; Package Shape: Rectangular; Case/Package: 0603; Terminal Finish: Nickel; Min Operating Temperature: -55°C; Max Operating Temperature: 155°C; JESD-609 Code: e3; Resistor Type: FIXED RESISTOR; Construction: Rectangular; Package Style: SMTMeter; Packaging: Tape and Reel; Technology: METAL GLAZE/THICK FILM; Termination: Wraparound; Reach SVHC Compliant: Yes; RoHS Compliant: Yes; ComponentLink1URL: https://datasheet.ciiva.com:443/pdfs/VipMasterIC/IC/SEIE/SEIE-S-A0009541969/SEIE-S-A0009541969-1.pdf?src-supplier=IHS+Markit; ComponentLink1Description: https://datasheet.ciiva.com:443/pdfs/VipMasterIC/IC/SEIE/SEIE-S-A0009541969/SEIE-S-A0009541969-1.pdf?src-supplier=IHS+Markit; ComponentLink2URL: https://www.seielect.com/catalog/SEI-RMCF_RMCP.pdf?src-supplier=Avnet; ComponentLink2Description: https://www.seielect.com/catalog/SEI-RMCF_RMCP.pdf?src-supplier=Avnet; ComponentLink3URL: https://www.seielect.com/Catalog/SEI-RMCF_RMCP.pdf?src-supplier=Digikey; ComponentLink3Description: https://www.seielect.com/Catalog/SEI-RMCF_RMCP.pdf?src-supplier=Digikey; ComponentLink4URL: https://www.seielect.com/catalog/SEI-Packaging.pdf?src-supplier=Digikey; ComponentLink4Description: https://www.seielect.com/catalog/SEI-Packaging.pdf?src-supplier=Digikey
TP2-TP12 = TP_1PIN_Hole: 200 mil hole test point
U5 = EFR32BG24B110F1536IM48-B: as U5 on sheet EFR32BG24_PartB; Supplier: Digikey; Supplier Part Number: 336-EFR32BG24B110F1536IM48-B-ND; Manufacturer Part Number: EFR32BG24B110F1536IM48-B; RoHS: No; Category: RF Receivers, Transceivers; Stock: 2713; Pricing: 1=7.9, 10=7.244, 25=6.5852, 80=5.92663, 230=5.43278, 490=4.9389, 980=4.44501 (USD)

## Sheet EFR32BG24_PartA.SchDoc: LPEDT_Project_Schematic
size A; Revision: 1; SheetNumber: 7; SheetTotal: 7
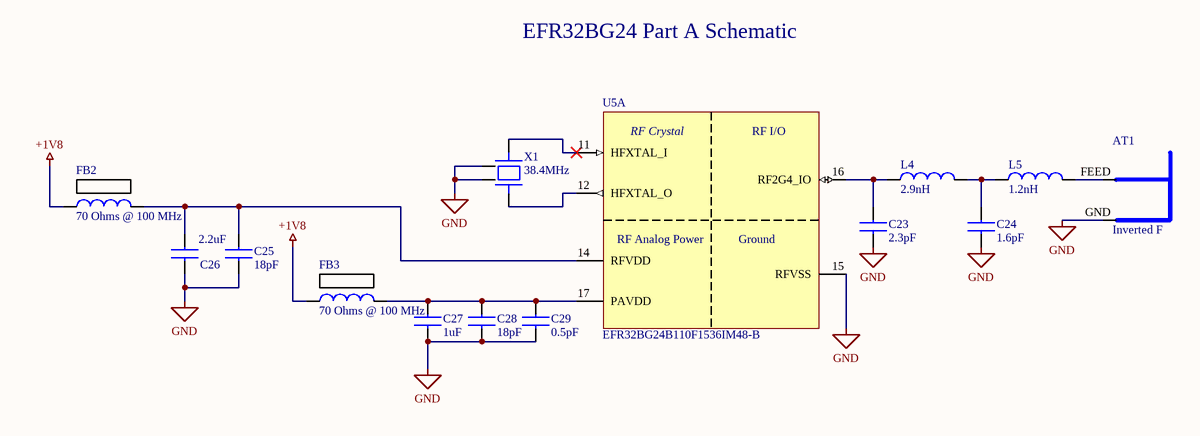
[diagram p6: EFR32BG24_PartA.SchDoc]

### Parts
AT1  Inverted F  [F_ANT]
C23  2.3pF  [C_0402]
C24  1.6pF  [C_0402]
C25  18pF  [C_0603]
C26  2.2uF  [C_0603]
C27  1uF  [C_0603]
C28  18pF  [C_0603]
C29  0.5pF  [C_0603]
FB2  70 Ohms @ 100 MHz  [FB_0603]
FB3  70 Ohms @ 100 MHz  [FB_0603]
L4  2.9nH  [L_0402]
L5  1.2nH  [L_0402]
U5  EFR32BG24B110F1536IM48-B  [U_48QFN_6x6_2]  (part A of 3)
X1  38.4MHz  [33Mhz Crystal]

### Nets
+1V8: FB2.1 FB3.1
GND: AT1.GND C23.2 C24.2 C25.2 C26.2 C27.2 C28.2 C29.2 U5.15(RFVSS) X1.2 X1.4
NetAT1_FEED: AT1.FEED L5.2
NetC23_1: C23.1 L4.1 U5.16(RF2G4_IO)
NetC24_1: C24.1 L4.2 L5.1
NetC25_1: C25.1 C26.1 FB2.2 U5.14(RFVDD)
NetC27_1: C27.1 C28.1 C29.1 FB3.2 U5.17(PAVDD)
NetU5_11: U5.11(HFXTAL_I) X1.3
NetU5_12: U5.12(HFXTAL_O) X1.1

### Notes on the sheet
- EFR32BG24 Part A Schematic
- (in symbol EFR32BG24B110F1536IM48-B, part A) RF Crystal; RF I/O; RF Analog Power; Ground

### Library data of the parts
AT1 = Antenna
C23 = C_2P3_0402: Ceramic Capacitor, Multilayer, Ceramic, 50V, 4.35% +Tol, 4.35% -Tol, C0G, 30ppm/Cel TC, 0.0000023uF, Surface Mount, 0402; Manufacturer: Murata; Manufacturer Part Number: GJM1555C1H2R3BB01D; Multilayer: Yes; Supplier: Digikey; Supplier Part Number: 490-GJM1555C1H2R3BB01DCT-ND; RoHS: Yes; Category: Ceramic Capacitors; Stock: 30945; Pricing: 1=0.1, 10=0.068, 50=0.0406, 100=0.0319, 500=0.02356, 1000=0.01951, 2500=0.01815, 5000=0.01661 (USD); Mounting Technology: Surface Mount; Pins: 2; Dielectric Material: Ceramic; Package Shape: Rectangular; Case/Package: 0402; Terminal Finish: Nickel; Min Operating Temperature: -55°C; Max Operating Temperature: 125°C; JESD-609 Code: e3; Value: 2.3pF; Capacitor Type: Ceramic; Tolerance  (fill in as +-): 4.35%; Package Style: SMTMeter; Packaging: Tape and Reel; Tolerance (fill in as +-): 4.35%; Rated DC Voltage (URdc): 50V; Temperature Characteristics Code: C0G; Termination: Wraparound; Length: 1mm; Width: 0.5mm; Height: 0.5mm; Reach SVHC Compliant: Yes; RoHS Compliant: Yes; ComponentLink1URL: https://datasheet.ciiva.com:443/pdfs/VipMasterIC/IC/MURE/MURE-S-A0004378008/MURE-S-A0004382787-1.pdf?src-supplier=IHS+Markit; ComponentLink1Description: https://datasheet.ciiva.com:443/pdfs/VipMasterIC/IC/MURE/MURE-S-A0004378008/MURE-S-A0004382787-1.pdf?src-supplier=IHS+Markit; ComponentLink2URL: https://datasheet.ciiva.com/166/product-166998.pdf?src-supplier=Digikey; ComponentLink2Description: https://datasheet.ciiva.com/166/product-166998.pdf?src-supplier=Digikey
C24 = C_1P6_0402: Ceramic Capacitor, Multilayer, Ceramic, 50V, 15.62% +Tol, 15.62% -Tol, C0G, 30ppm/Cel TC, 0.0000016uF, Surface Mount, 0402; Manufacturer: Murata; Manufacturer Part Number: GJM1555C1H1R6CB01D; Multilayer: Yes; Supplier: Digikey; Supplier Part Number: 490-3088-1-ND; RoHS: Yes; Category: Ceramic Capacitors; Stock: 26859; Pricing: 1=0.1, 10=0.047, 50=0.0272, 100=0.0211, 500=0.01586, 1000=0.01246, 2500=0.01133, 5000=0.01042 (USD); Mounting Technology: Surface Mount; Pins: 2; Dielectric Material: Ceramic; Package Shape: Rectangular; Case/Package: 0402; Terminal Finish: Nickel; Min Operating Temperature: -55°C; Max Operating Temperature: 125°C; JESD-609 Code: e3; Value: 1.6pF; Capacitor Type: Ceramic; Tolerance  (fill in as +-): 15.62%; Package Style: SMTMeter; Packaging: Tape and Reel; Tolerance (fill in as +-): 15.62%; Rated DC Voltage (URdc): 50V; Temperature Characteristics Code: C0G; Termination: Wraparound; Length: 1mm; Width: 0.5mm; Height: 0.5mm; Reach SVHC Compliant: Yes; RoHS Compliant: Yes; ComponentLink1URL: https://datasheet.ciiva.com:443/pdfs/VipMasterIC/IC/MURE/MURE-S-A0004378008/MURE-S-A0004382877-1.pdf?src-supplier=IHS+Markit; ComponentLink1Description: https://datasheet.ciiva.com:443/pdfs/VipMasterIC/IC/MURE/MURE-S-A0004378008/MURE-S-A0004382877-1.pdf?src-supplier=IHS+Markit; ComponentLink2URL: https://datasheet.ciiva.com/161/product-161712.pdf?src-supplier=Digikey; ComponentLink2Description: https://datasheet.ciiva.com/161/product-161712.pdf?src-supplier=Digikey; ComponentLink3URL: https://datasheet.ciiva.com/16440/gjm1555c1h1r6cb01d-16440474.pdf?src-supplier=Future+Electronics; ComponentLink3Description: https://datasheet.ciiva.com/16440/gjm1555c1h1r6cb01d-16440474.pdf?src-supplier=Future+Electronics; ComponentLink4URL: https://datasheet.ciiva.com/161/partnumbering-e-01-161713.pdf?src-supplier=Digikey; ComponentLink4Description: https://datasheet.ciiva.com/161/partnumbering-e-01-161713.pdf?src-supplier=Digikey; ComponentLink5URL: https://datasheet.ciiva.com/161/partnumbering-e-01-161714.pdf?src-supplier=Digikey; ComponentLink5Description: https://datasheet.ciiva.com/161/partnumbering-e-01-161714.pdf?src-supplier=Digikey
C25 C28 = C_18P_0603: Ceramic Capacitor, Multilayer, Ceramic, 50V, 5% +Tol, 5% -Tol, C0G, 30ppm/Cel TC, 0.000018uF, Surface Mount, 0603; Manufacturer: KEMET; Manufacturer Part Number: C0603C180J5GACTU; Multilayer: Yes; Supplier: Digikey; Supplier Part Number: 399-C0603C180J5GAC7867CT-ND; RoHS: Yes; Category: Ceramic Capacitors; Stock: 391868; Pricing: 1=0.1, 10=0.037, 50=0.0212, 100=0.0164, 500=0.01238, 1000=0.00972 (USD); Mounting Technology: Surface Mount; Pins: 2; Dielectric Material: Ceramic; Package Shape: Rectangular; Case/Package: 0603; Terminal Finish: Nickel; Min Operating Temperature: -55°C; Max Operating Temperature: 125°C; JESD-609 Code: e3; Value: 18pF; Capacitor Type: Ceramic; Tolerance  (fill in as +-): 5%; Package Style: SMTMeter; Packaging: Tape and Reel; Tolerance (fill in as +-): 5%; Rated DC Voltage (URdc): 50V; Temperature Characteristics Code: C0G; Termination: Wraparound; Length: 1.6mm; Width: 0.8mm; Height: 0.8mm; Reach SVHC Compliant: Yes; RoHS Compliant: Yes; ComponentLink1URL: https://datasheet.ciiva.com:443/pdfs/VipMasterIC/IC/KEME/KEME-S-A0007622587/KEME-S-A0007623064-1.pdf?src-supplier=IHS+Markit; ComponentLink1Description: https://datasheet.ciiva.com:443/pdfs/VipMasterIC/IC/KEME/KEME-S-A0007622587/KEME-S-A0007623064-1.pdf?src-supplier=IHS+Markit; ComponentLink2URL: https://datasheet.ciiva.com/7824/1372242-7824010.pdf?src-supplier=Element14; ComponentLink2Description: https://datasheet.ciiva.com/7824/1372242-7824010.pdf?src-supplier=Element14; ComponentLink3URL: https://datasheet.ciiva.com/7824/f9080b-0402-series-c0g-7824009.pdf?src-supplier=Element14; ComponentLink3Description: https://datasheet.ciiva.com/7824/f9080b-0402-series-c0g-7824009.pdf?src-supplier=Element14
C26 = C_2U2_0603: Ceramic Capacitor, Multilayer, Ceramic, 10V, 10% +Tol, 10% -Tol, X7R, 15% TC, 2.2uF, Surface Mount, 0603; Manufacturer: Samsung; Manufacturer Part Number: CL10B225KP8NNNC; Multilayer: Yes; Supplier: Digikey; Supplier Part Number: 1276-1134-1-ND; RoHS: Yes; Category: Ceramic Capacitors; Stock: 1035354; Pricing: 1=0.1, 10=0.07, 50=0.0418, 100=0.0329, 500=0.02428, 1000=0.0201 (USD); Mounting Technology: Surface Mount; Pins: 2; Dielectric Material: Ceramic; Package Shape: Rectangular; Case/Package: 0603; Terminal Finish: Nickel; Min Operating Temperature: -55°C; Max Operating Temperature: 125°C; JESD-609 Code: e3; Value: 2.2uF; Capacitor Type: Ceramic; Tolerance  (fill in as +-): 10%; Package Style: SMTMeter; Packaging: Tape and Reel; Tolerance (fill in as +-): 10%; Rated DC Voltage (URdc): 10V; Temperature Characteristics Code: X7R; Termination: Wraparound; Length: 1.6mm; Width: 0.8mm; Height: 0.9mm; Reach SVHC Compliant: Yes; RoHS Compliant: Yes; ComponentLink1URL: https://datasheet.ciiva.com:443/pdfs/VipMasterIC/IC/SEMS/SEMS-S-A0008384515/SEMS-S-A0008873307-1.pdf?src-supplier=IHS+Markit; ComponentLink1Description: https://datasheet.ciiva.com:443/pdfs/VipMasterIC/IC/SEMS/SEMS-S-A0008384515/SEMS-S-A0008873307-1.pdf?src-supplier=IHS+Markit; ComponentLink2URL: https://datasheet.ciiva.com/15227/getdatasheetpartid-359568-15227195.pdf?src-supplier=Verical; ComponentLink2Description: https://datasheet.ciiva.com/15227/getdatasheetpartid-359568-15227195.pdf?src-supplier=Verical; ComponentLink3URL: https://datasheet.ciiva.com/25798/cl10b225kp8nnnc-25798914.pdf?src-supplier=Digikey; ComponentLink3Description: https://datasheet.ciiva.com/25798/cl10b225kp8nnnc-25798914.pdf?src-supplier=Digikey; ComponentLink4URL: https://datasheet.ciiva.com/16500/cl10b225kp8nnnc-16500695.pdf?src-supplier=Future+Electronics; ComponentLink4Description: https://datasheet.ciiva.com/16500/cl10b225kp8nnnc-16500695.pdf?src-supplier=Future+Electronics; ComponentLink5URL: https://datasheet.ciiva.com/29198/457933-da-01-en-vs-kondensator-0603-29198589.pdf?src-supplier=Conrad; ComponentLink5Description: https://datasheet.ciiva.com/29198/457933-da-01-en-vs-kondensator-0603-29198589.pdf?src-supplier=Conrad
C27 = C_1U_0603: as C17 on sheet EFR32BG24_PartB; Supplier: Digikey; Supplier Part Number: 490-1543-1-ND; RoHS: Yes; Category: Ceramic Capacitors; Stock: 1314759; Pricing: 1=0.12, 10=0.08, 50=0.048, 100=0.0378, 500=0.02794, 1000=0.02313 (USD); Mounting Technology: Surface Mount; Pins: 2; Package Shape: Rectangular; Case/Package: 0603; Terminal Finish: Nickel; Min Operating Temperature: -55°C; Max Operating Temperature: 85°C; JESD-609 Code: e3; Value: 1uF; Capacitor Type: Ceramic; Package Style: SMTMeter; Packaging: Tape and Reel; Tolerance (fill in as +-): 10%; Rated DC Voltage (URdc): 10V; Temperature Characteristics Code: X5R; Termination: Wraparound; Length: 1.6mm; Width: 0.8mm; Height: 0.8mm; Reach SVHC Compliant: Yes; RoHS Compliant: Yes; ComponentLink1URL: https://psearch.en.murata.com:443/capacitor/product/GRM188R61A105KA61%23.pdf?src-supplier=IHS+Markit; ComponentLink1Description: https://psearch.en.murata.com:443/capacitor/product/GRM188R61A105KA61%23.pdf?src-supplier=IHS+Markit; ComponentLink2URL: https://datasheet.ciiva.com/19476/1857381-19476568.pdf?src-supplier=Jameco; ComponentLink2Description: https://datasheet.ciiva.com/19476/1857381-19476568.pdf?src-supplier=Jameco; ComponentLink3URL: https://datasheet.ciiva.com/18102/getdatasheetpartid-85467-18102910.pdf?src-supplier=Verical; ComponentLink3Description: https://datasheet.ciiva.com/18102/getdatasheetpartid-85467-18102910.pdf?src-supplier=Verical; ComponentLink4URL: https://datasheet.ciiva.com/7719/608985-7719036.pdf?src-supplier=Element14; ComponentLink4Description: https://datasheet.ciiva.com/7719/608985-7719036.pdf?src-supplier=Element14; ComponentLink5URL: https://datasheet.ciiva.com/22706/608985-22706782.pdf?src-supplier=Element14; ComponentLink5Description: https://datasheet.ciiva.com/22706/608985-22706782.pdf?src-supplier=Element14; ComponentLink6URL: https://datasheet.ciiva.com/131/partnumbering-e-01-131742.pdf?src-supplier=Digikey; ComponentLink6Description: https://datasheet.ciiva.com/131/partnumbering-e-01-131742.pdf?src-supplier=Digikey; ComponentLink7URL: https://datasheet.ciiva.com/131/partnumbering-e-01-131741.pdf?src-supplier=Digikey; ComponentLink7Description: https://datasheet.ciiva.com/131/partnumbering-e-01-131741.pdf?src-supplier=Digikey; ComponentLink8URL: https://datasheet.ciiva.com/131/partnumbering-e-01-131743.pdf?src-supplier=Digikey; ComponentLink8Description: https://datasheet.ciiva.com/131/partnumbering-e-01-131743.pdf?src-supplier=Digikey; ComponentLink9URL: https://datasheet.ciiva.com/16199/product-16199724.pdf?src-supplier=Future+Electronics; ComponentLink9Description: https://datasheet.ciiva.com/16199/product-16199724.pdf?src-supplier=Future+Electronics
C29 = C_0P5_0603: Cap Cer 0.5PF 250V C0G/NP0 0603; Manufacturer: Johanson; Manufacturer Part Number: QSCP251Q0R5A1GV001T; Supplier: Digikey; Supplier Part Number: 712-QSCP251Q0R5A1GV001TCT-ND; RoHS: No; Category: Ceramic Capacitors; Stock: 12633; Pricing: 1=0.36, 10=0.237, 50=0.1746, 100=0.1422, 500=0.11226, 1000=0.0948 (USD)
FB2 FB3 = BLM18SG700TN1D: Ferrite Chip, 1 Function(s), 4A, 2 Pin(s); Manufacturer: Murata; DC Resistance-Max: 20mR; Clock Frequency: 100MHz; Channels: 1; Output Impedance: 70R; Supplier: Digikey; Supplier Part Number: 490-5224-1-ND; Manufacturer Part Number: BLM18SG700TN1D; RoHS: Yes; Category: Ferrite Beads and Chips; Stock: 330015; Pricing: 1=0.13, 10=0.109, 25=0.0848, 50=0.0702, 100=0.0605, 250=0.0484, 500=0.04356, 1000=0.03631, 5000=0.03389 (USD); Mounting Technology: Surface Mount; Material: Ferrite; Case Code: 0603; Terminal Finish: Tin; Min Operating Temperature: -55°C; Max Operating Temperature: 125°C; JESD-609 Code: e3; Construction: Chip Bead; Filter Type: FERRITE CHIP; Min Frequency: 100MHz; Packaging: Tape and Reel; Current Rating: 4A; Length: 1.6mm; Width: 0.8mm; Height: 0.5mm; Reach SVHC Compliant: Yes; RoHS Compliant: Yes; ComponentLink1URL: https://datasheet.ciiva.com:443/pdfs/VipMasterIC/IC/MURE/MURE-S-A0008515766/MURE-S-A0008515869-1.pdf?src-supplier=IHS+Markit; ComponentLink1Description: https://datasheet.ciiva.com:443/pdfs/VipMasterIC/IC/MURE/MURE-S-A0008515766/MURE-S-A0008515869-1.pdf?src-supplier=IHS+Markit; ComponentLink2URL: https://datasheet.ciiva.com/41449/001171727-da-01-en-chip-drossel0603-70r-4000ma-1-6x0-8mm-41449356.pdf?src-supplier=Conrad; ComponentLink2Description: https://datasheet.ciiva.com/41449/001171727-da-01-en-chip-drossel0603-70r-4000ma-1-6x0-8mm-41449356.pdf?src-supplier=Conrad; ComponentLink3URL: https://datasheet.ciiva.com/41449/001172316-da-01-en-drossel-0603-70r-1-6x0-8mm-10000st-41449678.pdf?src-supplier=Conrad; ComponentLink3Description: https://datasheet.ciiva.com/41449/001172316-da-01-en-drossel-0603-70r-1-6x0-8mm-10000st-41449678.pdf?src-supplier=Conrad; ComponentLink4URL: https://datasheet.ciiva.com/8021/5151-8021530.pdf?src-supplier=Element14; ComponentLink4Description: https://datasheet.ciiva.com/8021/5151-8021530.pdf?src-supplier=Element14; ComponentLink5URL: https://datasheet.ciiva.com/14122/blm-series-eng-tds-14122901.pdf?src-supplier=Distrelec; ComponentLink5Description: https://datasheet.ciiva.com/14122/blm-series-eng-tds-14122901.pdf?src-supplier=Distrelec; ComponentLink6URL: https://datasheet.ciiva.com/8021/5151-8021529.pdf?src-supplier=Element14; ComponentLink6Description: https://datasheet.ciiva.com/8021/5151-8021529.pdf?src-supplier=Element14; ComponentLink7URL: https://datasheet.ciiva.com/6212/l0110s0100blm18s-6212357.pdf?src-supplier=Digikey; ComponentLink7Description: https://datasheet.ciiva.com/6212/l0110s0100blm18s-6212357.pdf?src-supplier=Digikey
L4 = L_2N9_0402: General Purpose Inductor, 0.0029uH, 10.345%, 1 Element, SMD, 0402; Manufacturer: Murata; Manufacturer Part Number: LQG15WZ2N9S02D; Supplier: Digikey; Supplier Part Number: 490-LQG15WZ2N9S02DCT-ND; RoHS: Yes; Category: Fixed Inductors; Stock: 19729; Pricing: 1=0.12, 10=0.099, 25=0.0912, 50=0.0804, 100=0.0703, 250=0.06696, 500=0.06294, 1000=0.0482, 2500=0.04553 (USD)
L5 = L_1N2_0402: General Purpose Inductor, 0.0012uH, 8.333%, 1 Element, SMD, 0402; Manufacturer: Murata; Manufacturer Part Number: LQG15HS1N2B02D; DC Resistance (DCR): 70mR; Inductor Application: RF INDUCTOR; Channels: 1; Quality Factor-Min (at L-nom): 8; Max Current Rating: 1A; Self Resonant Frequency: 6GHz; Shape/Size Description: RECTANGULAR PACKAGE; Shielding: Unshielded; Test Frequency: 100MHz; Supplier: Digikey; Supplier Part Number: 490-LQG15HS1N2B02DCT-ND; RoHS: Yes; Category: Fixed Inductors; Stock: 9740; Pricing: 1=0.1, 10=0.065, 25=0.0596, 50=0.0526, 100=0.046, 250=0.04376, 500=0.04114, 1000=0.03152, 2500=0.02977 (USD); Pins: 2; Terminal Finish: Tin; Min Operating Temperature: -55°C; Max Operating Temperature: 125°C; Tolerance: 8.333%; JESD-609 Code: e3; Inductance-Nom (L): 0.0012uH; Inductor Type: GENERAL PURPOSE INDUCTOR; Surface Mount: Yes; Terminal Placement: Dual Ended; Termination: Wraparound; Reach SVHC Compliant: Yes; RoHS Compliant: Yes; ComponentLink1URL: https://psearch.en.murata.com:443/inductor/product/LQG15HS1N2B02_.pdf?src-supplier=IHS+Markit; ComponentLink1Description: https://psearch.en.murata.com:443/inductor/product/LQG15HS1N2B02_.pdf?src-supplier=IHS+Markit
U5 = EFR32BG24B110F1536IM48-B: as U5 on sheet EFR32BG24_PartB; Supplier: Digikey; Supplier Part Number: 336-EFR32BG24B110F1536IM48-B-ND; Manufacturer Part Number: EFR32BG24B110F1536IM48-B; RoHS: No; Category: RF Receivers, Transceivers; Stock: 2713; Pricing: 1=7.9, 10=7.244, 25=6.5852, 80=5.92663, 230=5.43278, 490=4.9389, 980=4.44501 (USD)
X1 = X_39M_0302: Parallel - Fundamental Quartz Crystal, 38.4MHz Nom; Manufacturer: Raltron Electronics; Manufacturer Part Number: RH100-38.400-10-F-1010-TR; Supplier: Digikey; Supplier Part Number: 2151-RH100-38.400-10-F-1010-TRCT-ND; RoHS: Yes; Category: Crystals and Oscillators; Stock: 14924; Pricing: 1=0.24, 10=0.203, 50=0.1828, 100=0.1625, 500=0.15442, 1000=0.13004 (USD)

## Nets that join several sheets
+1V8: EFR32BG24_PartB (C13.1 C14.1 L3.2 U5.40), EFR32BG24_PartA (FB2.1 FB3.1)
+3V3: MPL3115A2 (C1.1 C2.2 U1.1 U1.4), AS7331 (C4.2 FB1.1 U2.10), Si7021 (C6.1 U3.3 U3.4 U3.5), BQ25570 (LOAD_CURR_SENSE.2 R26.2), EFR32BG24_PartB (10 pins), EFR32BG24_PartC (H1.1 R10.2 R11.2)
GND: MPL3115A2 (C1.2 C2.1 C3.2 U1.3), AS7331 (12 pins), Si7021 (C6.2 U3.2 U3.Paddle), BQ25570 (27 pins), EFR32BG24_PartB (16 pins), EFR32BG24_PartC (6 pins), EFR32BG24_PartA (11 pins)
I2C_SCL: MPL3115A2 (R4.2), AS7331 (R8.2), Si7021 (R12.2), EFR32BG24_PartC (R10.1 TP11.1 U5.6)
I2C_SDA: MPL3115A2 (R5.2), AS7331 (R7.2), Si7021 (R9.2), EFR32BG24_PartC (R11.1 TP12.1 U5.8)
INT1_MPL3115A2: MPL3115A2 (R19.2), EFR32BG24_PartC (TP9.1 U5.23)
INT2_MPL3115A2: MPL3115A2 (R20.2), EFR32BG24_PartC (TP10.1 U5.22)
NetH1_3: EFR32BG24_PartB (R22.2 U5.13), EFR32BG24_PartC (H1.3)